# EAGLE design SunlightDetector (EAGLE 7.3.0)
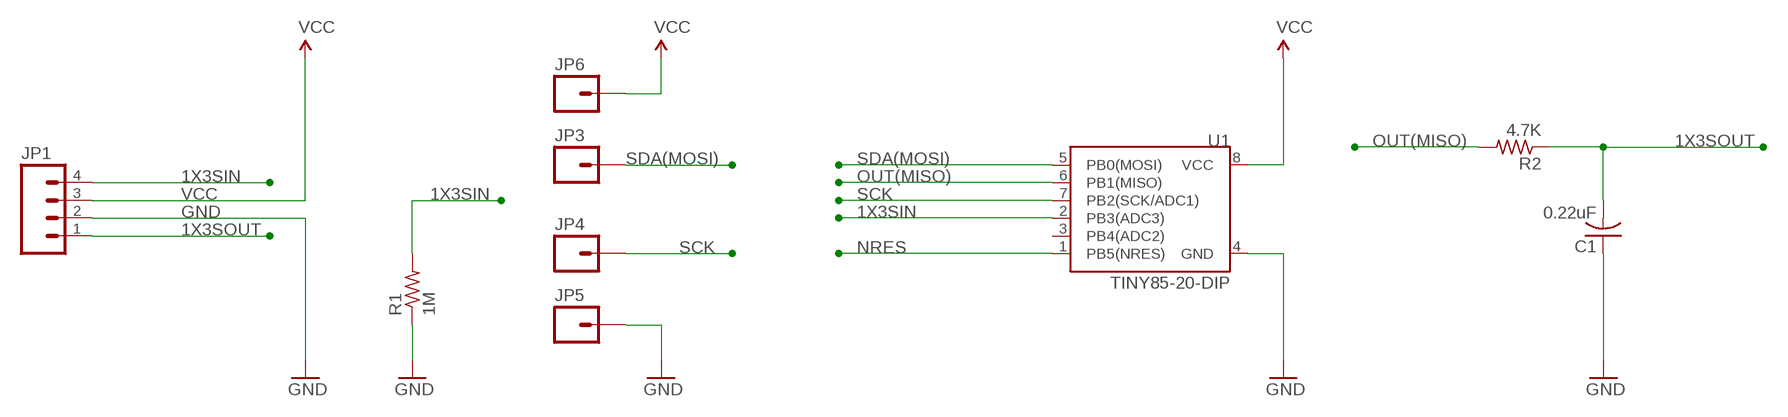
[diagram p0: schematic, sheet 1]

## Parts
C1  0.22uF  C-USC0402  [C0402]
JP1  M04PTH  [1X04]
JP3  M01PTH  [1X01]
JP4  M01PTH  [1X01]
JP5  M01PTH  [1X01]
JP6  M01PTH  [1X01]
R1  1M  R-US_R0603  [R0603]
R2  4.7K  R-US_R0603  [R0603]
U1  TINY85-20-DIP  ATTINY45TINY85-20-DIP  [DIP08]

## Nets
1X3SIN: JP1.4 R1.2 U1.2(PB3(ADC3))
1X3SOUT: C1.2 JP1.1 R2.1
GND: C1.1 JP1.2 JP5.1 R1.1 U1.4(GND)
NRES: U1.1(PB5(NRES))
OUT(MISO): R2.2 U1.6(PB1(MISO))
SCK: JP4.1 U1.7(PB2(SCK/ADC1))
SDA(MOSI): JP3.1 U1.5(PB0(MOSI))
VCC: JP1.3 JP6.1 U1.8(VCC)
Unconnected: U1.3(PB4(ADC2))

## Library data of the parts
C1 = adafruit:C-US: CAPACITOR, American symbol
JP1 = SparkFun-Connectors:M04: Header 4 Standard 4-pin 0.1" header. Use with straight break away headers (SKU : PRT-00116), right angle break away headers (PRT-00553), swiss pins (PRT-00743), machine pins (PRT-00117), and female headers (PRT-00115). Molex polarized connector foot print use with SKU : PRT-08231 with associated crimp pins and housings. 1MM SMD Version SKU: PRT-10208
JP3-JP6 = SparkFun-Connectors:M01: Header 1 Standard 1-pin 0.1" header. Use with straight break away headers (SKU : PRT-00116), right angle break away headers (PRT-00553), swiss pins (PRT-00743), machine pins (PRT-00117), and female headers (PRT-00115).
R1 R2 = adafruit:R-US_: RESISTOR, American symbol
U1 = SparkFun-DigitalIC:ATTINY45: Atmel 8-pin 2/4/8kB flash uC; PROD_ID: IC-09445

## Board
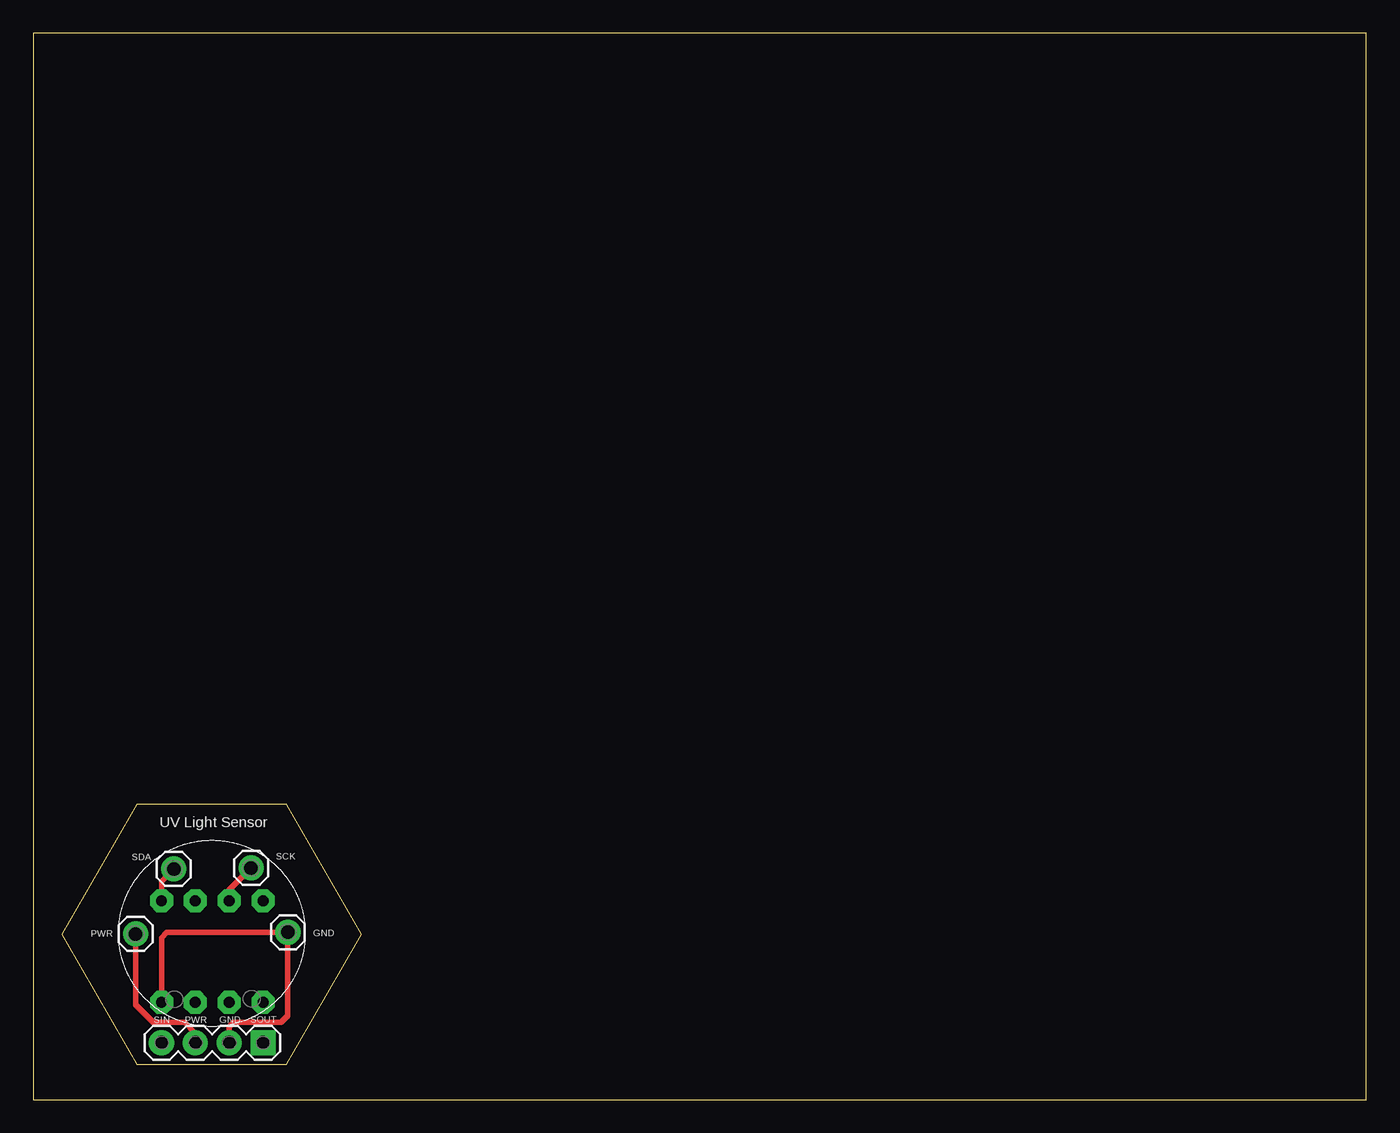
[diagram p1: board, top side]
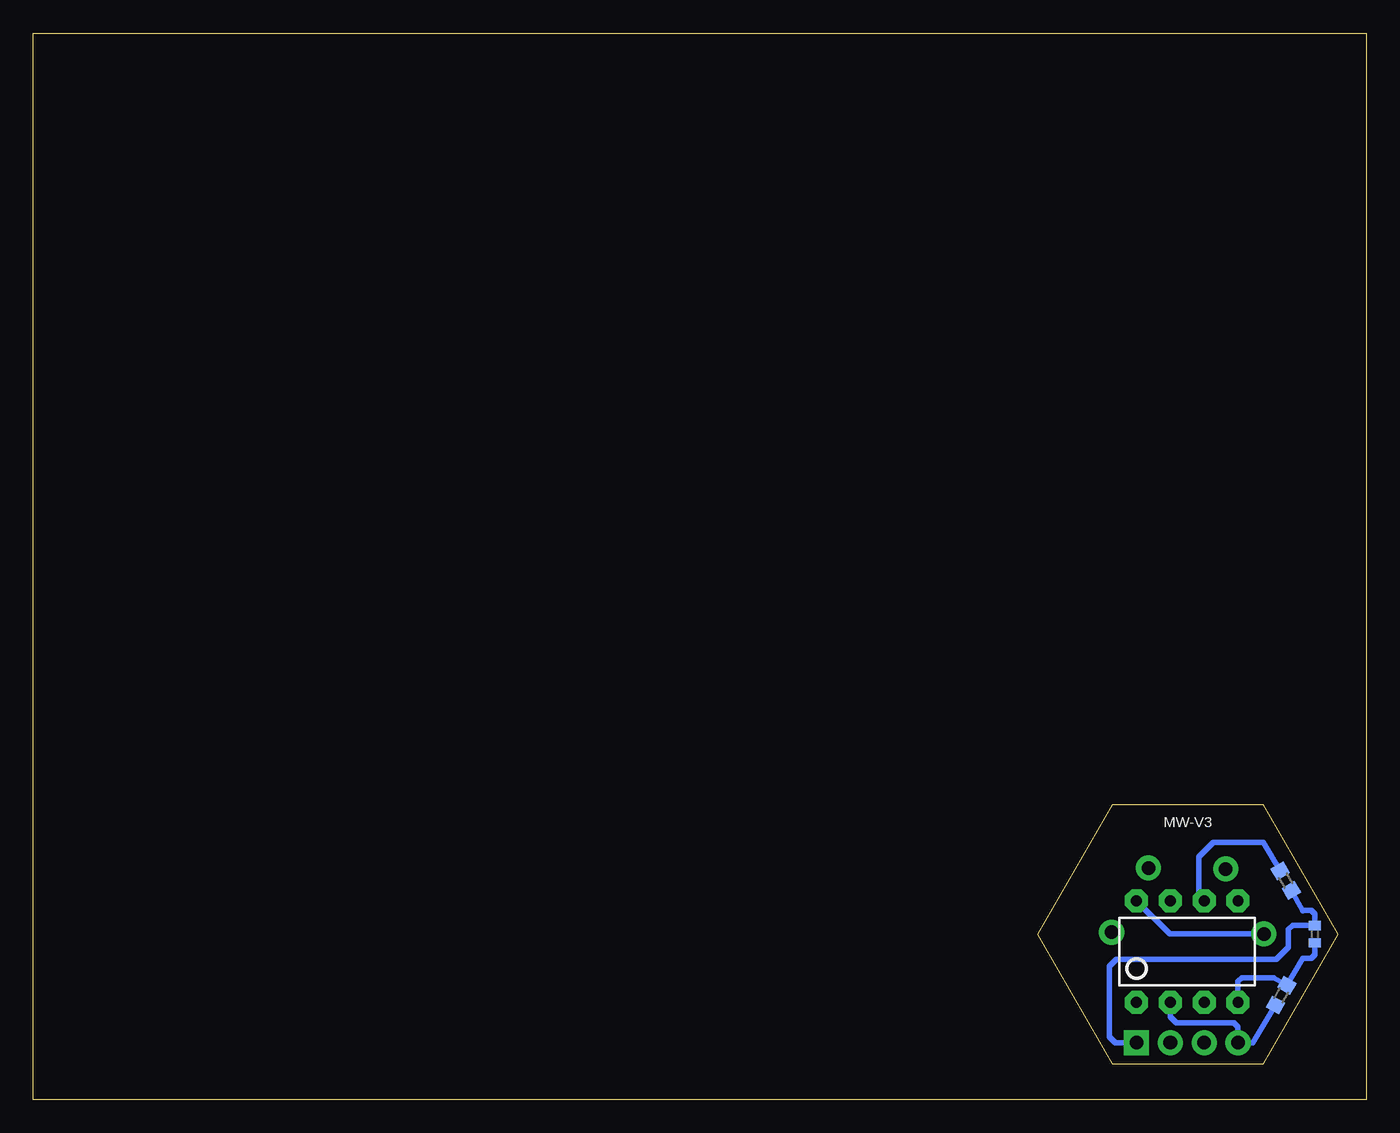
[diagram p2: board, bottom side, seen from below]

Size 100 x 80 mm. Coordinates in mm from the lower left corner, seen from the top.
Outline: 0,0 100,0 100,80 0,80 0,0
Outline: 7.77,2.66 19.02,2.66 24.64,12.4 19.02,22.14 7.77,22.14 2.15,12.4 7.77,2.66
Copper layers (1*16): Top 0.035mm / dielectric 1.5mm / Bottom 0.035mm
Design rules "default *": minimum track width 10mil, minimum drill 24mil, track to track 8mil, track to pad 8mil, pad to pad 8mil, via to via 8mil, smd to smd 8mil, copper to edge 0mil, drill to drill 8mil, minimum pad ring 10mil, minimum via ring 8mil, stop-mask expansion 4mil, vias tented up to drill 0mil, thermal gap 10mil

### Footprints (pad centres in the part's own frame; a part is rotated, then mirrored left to right if it is on the bottom)
C0402 = smd 0.7 x 0.9: 1 -0.65,0; 2 0.65,0
1X04 = drill 1.016 pad 1.88 square: 1 0,0 | drill 1.016 pad 1.88: 2 2.54,0; 3 5.08,0; 4 7.62,0
1X01 = drill 1.016 pad 1.88: 1 0,0
R0603 = smd 1 x 1.1: 1 -0.85,0; 2 0.85,0
DIP08 = drill 0.813 pad 1.727 octagon: 1 -3.81,-3.81; 2 -1.27,-3.81; 3 1.27,-3.81; 4 3.81,-3.81; 5 3.81,3.81; 6 1.27,3.81; 7 -1.27,3.81; 8 -3.81,3.81

### Placement (x,y rotation side)
C1  3.85,12.41 90 bottom
JP1  17.23,4.27 180 top
JP3  10.54,17.3 0 top
JP4  16.33,17.37 0 top
JP5  19.1,12.55 0 top
JP6  7.67,12.42 0 top
R1  6.38,7.82 240 bottom
R2  6.03,16.42 120 bottom
U1  13.42,11.1 0 bottom

### Tracks (layer width: path | path; a pad name or v marks a point on that pad's centre or on a via)
1X3SIN
  Bottom 0.4: R1.2 8.5,4.27 JP1.4 9.63,4.28 9.63,5.46 9.93,5.77 14.26,5.77 14.69,6.2 U1.2
1X3SOUT
  Bottom 0.4: R2.1 4.75,14.17 4.74,14.19 4.12,14.19 3.85,13.92 C1.2 5.51,13.07 5.83,12.75 5.83,11.42 6.74,10.5 18.75,10.5 19.27,9.98 19.27,4.71 18.82,4.27 JP1.1
GND
  Top 0.4: U1.4 9.61,12.13 10.02,12.54 13.3,12.54 13.31,12.55 JP5.1 19.09,12.54 19.09,6.3 18.58,5.79 15.02,5.79 14.69,5.46 JP1.2
  Bottom 0.4: C1.1 3.85,10.87 4.12,10.6 4.75,10.6 R1.1 6.92,9.14 9.32,9.14 9.61,8.85 U1.4
OUT(MISO)
  Bottom 0.4: R2.2 7.73,19.29 11.48,19.29 12.57,18.2 12.57,15.33 U1.6
SCK
  Top 0.4: U1.7 14.69,15.73 JP4.1
SDA(MOSI)
  Top 0.4: U1.5 9.61,16.37 JP3.1
VCC
  Top 0.4: JP1.3 12.15,4.98 11.35,5.78 9,5.78 7.67,7.11 JP6.1
  Bottom 0.4: JP6.1 14.74,12.42 U1.8

### Text on the board
tPlace: UV Light Sensor | SDA | SCK | PWR | GND | SIN | PWR | GND | SOUT
bPlace: MW-V3